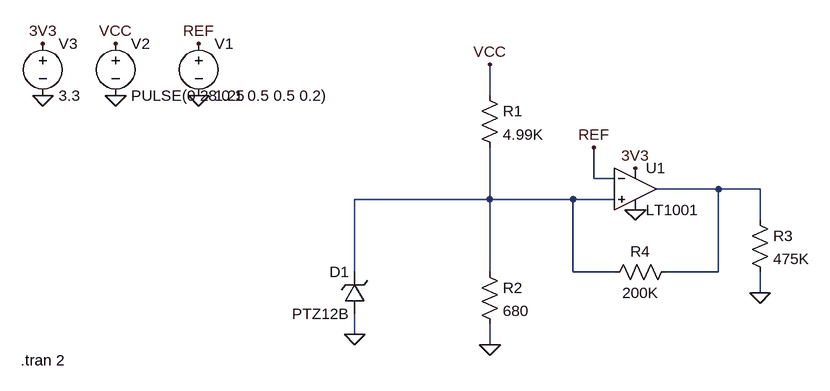
[diagram p0: schematic VoltageSens.asc]
VoltageSens.asc, the LTspice schematic file:
Version 4
SHEET 1 1028 696
WIRE 528 272 528 224
WIRE 688 400 688 352
WIRE 720 400 688 400
WIRE 880 416 784 416
WIRE 944 416 880 416
WIRE 528 432 528 352
WIRE 528 432 320 432
WIRE 656 432 528 432
WIRE 720 432 656 432
WIRE 944 464 944 416
WIRE 320 544 320 432
WIRE 528 544 528 432
WIRE 656 544 656 432
WIRE 720 544 656 544
WIRE 880 544 880 416
WIRE 880 544 800 544
WIRE 944 576 944 544
WIRE 320 640 320 608
WIRE 528 656 528 624
FLAG 320 640 0
FLAG 528 656 0
FLAG 528 224 VCC
FLAG 688 352 REF
FLAG 752 384 3V3
FLAG 752 448 0
FLAG 944 576 0
FLAG 80 272 0
FLAG -48 272 0
FLAG -160 272 0
FLAG -160 192 3V3
FLAG -48 192 VCC
FLAG 80 192 REF
SYMBOL res 512 256 R0
SYMATTR InstName R1
SYMATTR Value 4.99K
SYMATTR SpiceLine tol=1 pwr=0.1
SYMBOL res 512 528 R0
SYMATTR InstName R2
SYMATTR Value 680
SYMBOL zener 336 608 R180
WINDOW 0 24 64 Left 2
WINDOW 3 24 0 Left 2
SYMATTR InstName D1
SYMATTR Value PTZ12B
SYMATTR Description Diode
SYMATTR Type diode
SYMBOL Opamps\\LT1001 752 352 R0
SYMATTR InstName U1
SYMBOL res 928 448 R0
SYMATTR InstName R3
SYMATTR Value 475K
SYMATTR SpiceLine tol=1 pwr=0.1
SYMBOL voltage 80 176 R0
WINDOW 123 0 0 Left 0
WINDOW 39 0 0 Left 0
SYMATTR InstName V1
SYMATTR Value 1.25
SYMBOL voltage -48 176 R0
WINDOW 123 0 0 Left 0
WINDOW 39 0 0 Left 0
SYMATTR InstName V2
SYMATTR Value PULSE(0 28 0.1 0.5 0.5 0.2)
SYMBOL voltage -160 176 R0
WINDOW 123 0 0 Left 0
WINDOW 39 0 0 Left 0
SYMATTR InstName V3
SYMATTR Value 3.3
SYMBOL res 816 528 R90
WINDOW 0 0 56 VBottom 2
WINDOW 3 32 56 VTop 2
SYMATTR InstName R4
SYMATTR Value 200K
SYMATTR SpiceLine tol=1 pwr=0.1
TEXT -194 680 Left 2 !.tran 2

The netlist it stands for:
* VoltageSens.asc
R1 VCC N002 4.99K tol=1 pwr=0.1
R2 N002 0 680
D1 0 N002 PTZ12B
XU1 N002 REF 3V3 0 N001 LT1001  ; pins In+ In- V+ V- OUT
R3 N001 0 475K tol=1 pwr=0.1
V1 REF 0 1.25
V2 VCC 0 PULSE(0 28 0.1 0.5 0.5 0.2)
V3 3V3 0 3.3
R4 N001 N002 200K tol=1 pwr=0.1
.model D D
.lib standard.dio
.tran 2
.lib LTC.lib
.backanno
.end